# EAGLE design untitled.bcpb (EAGLE 5.06)
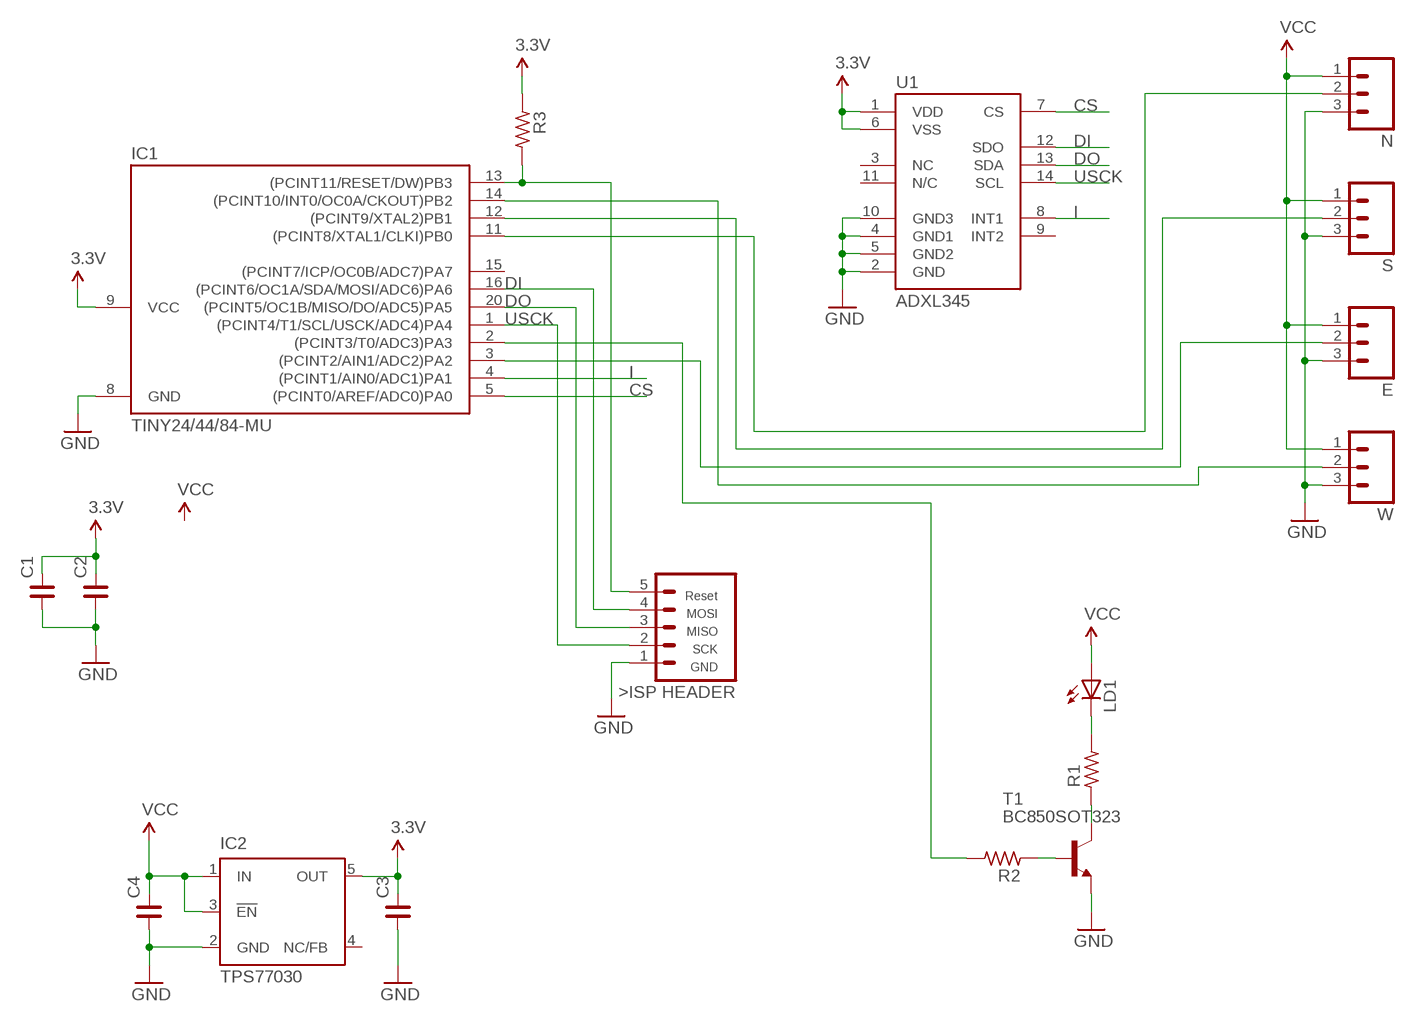
[diagram p0: schematic, sheet 1]

## Parts
C1  C_0402  [C0402]
C2  C_0402  [C0402]
C3  C_0805  [C0805]
C4  C_0805  [C0805]
E  M03LOCK  [1X03_LOCK]
IC1  TINY24/44/84-MU  [QFN/MLF20]
IC2  TPS77030  [SOT23-DBV]
LD1  LEDP-LCC-2  [P-LCC-2]
N  M03LOCK  [1X03_LOCK]
R1  R_0603  [R0603]
R2  R_0603  [R0603]
R3  R_0603  [R0603]
S  M03LOCK  [1X03_LOCK]
T1  BC850SOT323  [SOT323-BEC]
U1  ADXL345  [LGA14]
U$1  ISPHEADER  [1X05]
W  M03LOCK  [1X03_LOCK]

## Nets
3.3V: C1.2 C2.2 C3.2 IC1.9(VCC) IC2.5(OUT) R3.1 U1.1(VDD) U1.6(VSS)
CS: IC1.5((PCINT0/AREF/ADC0)PA0) U1.7(CS)
DI: IC1.16((PCINT6/OC1A/SDA/MOSI/ADC6)PA6) U1.12(SDO) U$1.4(MOSI)
DO: IC1.20((PCINT5/OC1B/MISO/DO/ADC5)PA5) U1.13(SDA) U$1.3(MISO)
GND: C1.1 C2.1 C3.1 C4.1 E.3 IC1.8(GND) IC2.2(GND) N.3 S.3 T1.E U1.2(GND) U1.4(GND1) U1.5(GND2) U1.10(GND3) U$1.1(GND) W.3
I: IC1.4((PCINT1/AIN0/ADC1)PA1) U1.8(INT1)
N$1: IC1.13((PCINT11/RESET/DW)PB3) R3.2 U$1.5(RST)
N$2: IC1.12((PCINT9/XTAL2)PB1) S.2
N$3: LD1.C R1.2
N$4: R1.1 T1.C
N$5: R2.1 T1.B
N$8: IC1.11((PCINT8/XTAL1/CLKI)PB0) N.2
N$11: E.2 IC1.3((PCINT2/AIN1/ADC2)PA2)
N$12: IC1.14((PCINT10/INT0/OC0A/CKOUT)PB2) W.2
N$13: IC1.2((PCINT3/T0/ADC3)PA3) R2.2
USCK: IC1.1((PCINT4/T1/SCL/USCK/ADC4)PA4) U1.14(SCL) U$1.2(SCK)
VCC: C4.2 E.1 IC2.1(IN) IC2.3(!EN) LD1.A N.1 S.1 W.1
Unconnected: IC1.15((PCINT7/ICP/OC0B/ADC7)PA7) IC2.4(NC/FB) U1.3(NC) U1.9(INT2) U1.11(N/C)

## Library data of the parts
C1-C4 = rc-master:C_: NON-POLARIZED CAP
E N S W = SparkFun:M03: Header 3 Standard 3-pin 0.1" header. Use with straight break away headers (SKU : PRT-00116), right angle break away headers (PRT-00553), swiss pins (PRT-00743), machine pins (PRT-00117), and female headers (PRT-00115). Molex polarized connector foot print use with SKU : PRT-08232 with associated crimp pins and housings.
IC1 = avr-5:TINY24/44/84
IC2 = texas:TPS770*: ULTRALOW-POWER 50-mA LOW-DROPOUT LINEAR REGULATORS 50-mA Low-Dropout Regulator Source: http://focus.ti.com/lit/ds/symlink/tps77001.pdf
LD1 = led:LED: LED OSRAM: - CHIPLED LG R971, LG N971, LY N971, LG Q971, LY Q971, LO R971, LY R971 LH N974, LH R974 LS Q976, LO Q976, LY Q976 LO Q996 - Hyper CHIPLED LW Q18S LB Q993, LB Q99A, LB R99A - SideLED LS A670, LO A670, LY A670, LG A670, LP A670 LB A673, LV A673, LT A673, LW A673 LH A674 LY A675 LS A676, LA A676, LO A676, LY A676, LW A676 LS A679, LY A679, LG A679 - Hyper Micro SIDELED® LS Y876, LA Y876, LO Y876, LY Y876 LT Y87S - SmartLED LW L88C, LW L88S LB L89C, LB L89S, LG L890 LS L89K, LO L89K, LY L89K LS L896, LA L896, LO L896, LY L896 - TOPLED LS T670, LO T670, LY T670, LG T670, LP T670 LSG T670, LSP T670, LSY T670, LOP T670, LYG T670 LG T671, LOG T671, LSG T671 LB T673, LV T673, LT T673, LW T673 LH T674 LS T676, LA T676, LO T676, LY T676, LB T676, LH T676, LSB T676, LW T676 LB T67C, LV T67C, LT T67C, LS T67K, LO T67K, LY T67K, LW E67C LS E67B, LA E67B, LO E67B, LY E67B, LB E67C, LV E67C, LT E67C LW T67C LS T679, LY T679, LG T679 LS T770, LO T770, LY T770, LG T770, LP T770 LB T773, LV T773, LT T773, LW T773 LH T774 LS E675, LA E675, LY E675, LS T675 LS T776, LA T776, LO T776, LY T776, LB T776 LHGB T686 LT T68C, LB T68C - Hyper Mini TOPLED® LB M676 - Mini TOPLED Santana® LG M470 LS M47K, LO M47K, LY M47K Source: http://www.osram.convergy.de/
R1-R3 = rc-master:R_: RESISTOR
T1 = additional:BC850: NPN TRANSISTOR
U1 = SparkFun:ADXL345
U$1 = tuxgraphics:ISPHEADER: ISP Header for tuxgraphics.org AvrUsb500 programmer

## Board
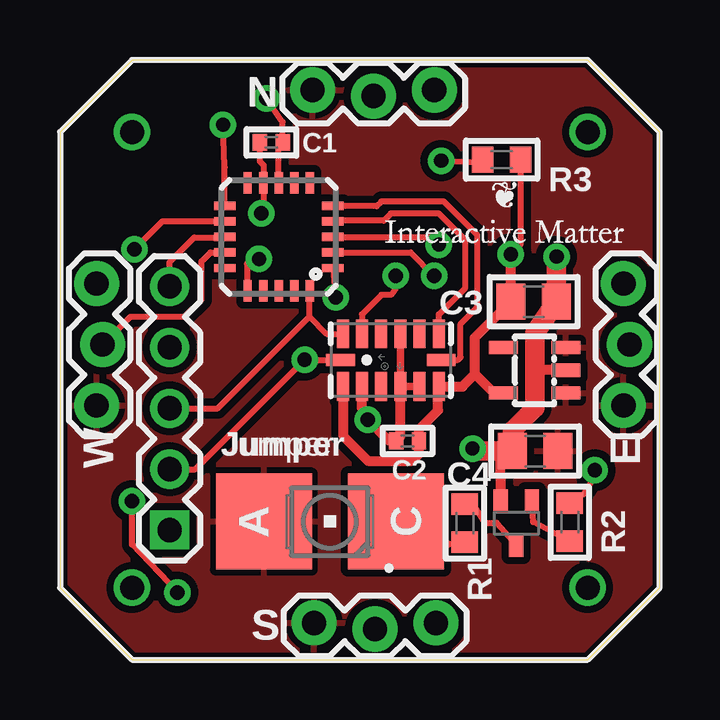
[diagram p1: board, top side]
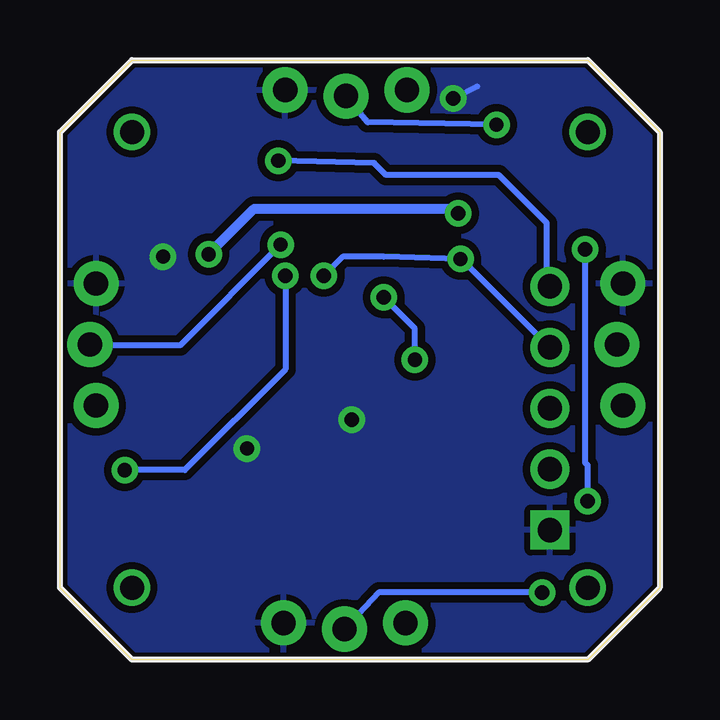
[diagram p2: board, bottom side, seen from below]

Size 25 x 25 mm. Coordinates in mm from the lower left corner, seen from the top.
Outline: 0,3 3,0 22,0 25,3 25,22 22,25 3,25 0,22 0,3
Copper layers (1*16): Top 0.035mm / dielectric 1.5mm / Bottom 0.035mm
Design rules "SparkFun": minimum track width 8mil, minimum drill 20mil, track to track 8mil, track to pad 8mil, pad to pad 8mil, via to via 8mil, smd to smd 0mil, copper to edge 10mil, drill to drill 8mil, minimum pad ring 12mil, minimum via ring 10mil, stop-mask expansion 4mil, vias tented up to drill 25mil, thermal gap 10mil

### Footprints (pad centres in the part's own frame; a part is rotated, then mirrored left to right if it is on the bottom)
C0402 = smd 0.6 x 0.7: 1 -0.476,0; 2 0.476,0
C0805 = smd 1.2 x 1.5: 1 -0.953,0; 2 0.953,0
1X03_LOCK = drill 1.016 pad 1.88 round: 1 0,0.127; 2 2.54,-0.127; 3 5.08,0.127
QFN/MLF20 = smd 0.9 x 0.35: 1 -2.25,1.3; 2 -2.25,0.65; 3 -2.25,0; 4 -2.25,-0.65; 5 -2.25,-1.3; 11 2.25,-1.3; 12 2.25,-0.65; 13 2.25,0; 14 2.25,0.65; 15 2.25,1.3 | smd 0.35 x 0.9: 6 -1.3,-2.25; 7 -0.65,-2.25; 8 0,-2.25; 9 0.65,-2.25; 10 1.3,-2.25; 16 1.3,2.25; 17 0.65,2.25; 18 0,2.25; 19 -0.65,2.25; 20 -1.3,2.25
SOT23-DBV = smd 0.55 x 1.2: 1 -0.95,-1.3; 2 0,-1.3; 3 0.95,-1.3; 4 0.95,1.3; 5 -0.95,1.3
P-LCC-2 = smd 4 x 4: A 0,2.75; C 0,-2.75
R0603 = smd 0.9 x 1.1: 1 -0.794,0; 2 0.794,0
SOT323-BEC = smd 0.6 x 1: B -0.65,-0.9; C 0,0.9; E 0.65,-0.9
LGA14 = smd 0.5 x 1.2: 1 2,1.1; 2 1.2,1.1; 3 0.4,1.1; 4 -0.4,1.1; 5 -1.2,1.1; 6 -2,1.1; 8 -2,-1.1; 9 -1.2,-1.1; 10 -0.4,-1.1; 11 0.4,-1.1; 12 1.2,-1.1; 13 2,-1.1 | smd 1.2 x 0.5: 7 -2.1,0; 14 2.1,0
1X05 = drill 1.016 square: 1 0,0 | drill 1.016 round: 2 2.54,0; 3 5.08,0; 4 7.62,0; 5 10.16,0

### Placement (x,y rotation side)
C1  8.81,21.56 180 top
C2  14.49,9.12 0 top
C3  19.75,14.92 180 top
C4  19.81,8.69 0 top
E  23.62,10.6 90 top
IC1  9.12,17.62 180 top
IC2  19.79,12.06 90 top
LD1  11.25,5.75 90 top
N  10.53,23.62 0 top
R1  16.88,5.69 270 top
R2  21.25,5.72 90 top
R3  18.41,20.85 180 top
S  10.6,1.4 0 top
T1  19.03,5.69 180 top
U1  13.79,12.48 180 top
U$1  4.57,5.4 90 top
U$2  [VERY_SMALL]  13.4,16.9 0 top
W  1.65,10.6 90 top

### Tracks (layer width: path | path; a pad name or v marks a point on that pad's centre or on a via)
3.3V  (via drill 0.6)
  Top 0.254: C1.2 8.34,20.76 8.5,20.6 8.5,19.9 | 8.5,19.9 IC1.9 | 8.5,19.9 8.5,18.9 v8.4,18.6 | C3.2 | R3.1 19.21,17.31 v18.8,16.9
  Top 0.305: 15.76,11.35 U1.6 | 11.82,11.35 U1.1
  Top 0.406: 15.76,11.35 15.76,10.39 14.97,9.59 C2.2 14.97,8.58 14.68,8.29 12.84,8.29 11.82,9.31 11.82,11.35 | C3.2 v18.8,16.9 | C3.2 17.3,13.43 17.3,11.9 | 17.3,11.9 16.78,11.38 U1.6 | 17.3,11.9 18.09,11.11 IC2.5
  Bottom 0.406: v8.4,18.6 8.5,18.6 8.7,18.8 16.9,18.8 v18.8,16.9
CS
  Top 0.254: U1.7 16.18,12.48 16.2,12.5 16.6,12.5 16.7,12.6 16.7,14 17.4,14.7 17.4,17.7 16,19.1 13.4,19.1 13.2,18.9 11.4,18.9 IC1.5
DI  (via drill 0.6)
  Top 0.254: U1.12 12.59,14.39 13.4,15.2 13.8,15.2 14,15.5 v14,16 | v8.3,16.7 8.4,17.1 7.8,16.5 7.8,15.4 IC1.16
  Bottom 0.254: U$1.4 8.26,16.7 8.45,16.75 v8.3,16.7 11.5,16.8 13.2,16.8 v14,16
DO
  Top 0.254: U1.13 11.12,13.58 10.4,14.3 | 10.4,14.3 10.4,15.35 IC1.20 | U$1.3 6.58,10.48 10.4,14.3
GND  (via drill 0.6)
  Top 0.254: IC1.8 9.12,21.39 C1.1 9.29,22.41 v8.6,23.4 | v20.7,16.8
  Top 0.305: U1.5 U1.4 U1.10 | 14.19,9.29 C2.1 13.73,9.12
  Top 0.406: 14.19,9.29 U1.4 | U1.2 12.59,10.51 v12.84,10.01 13.73,9.12 | T1.E 18.36,8.71 C4.1 18.86,9.56 | IC2.2 21.05,12.1 19.8,12.1
  Top 0.813: v17.2,8.8 17.29,8.69 C4.1 | v20.7,16.8 C3.1 19.8,13.62 19.8,12.1 19.8,10.5 18.86,9.56
  Bottom 0.254: v8.6,23.4 7.6,23.9 | v20.7,16.8 20.7,16.9 20.6,17
  Bottom 0.305: v12.84,10.01 13.03,10.26 13.09,10.32
  pour Bottom (isolate 0.305): -0.5,-0.5 -0.5,25.5 25.5,25.5 25.5,-0.5
I
  Top 0.254: U1.8 15.79,14.39 16.9,15.5 16.9,17.5 15.8,18.6 13.8,18.6 13.5,18.3 11.4,18.3 IC1.4
N$1  (via drill 0.6)
  Top 0.254: U$1.5 4.57,16.57 5.6,17.6 6.85,17.6 IC1.13 | R3.2 17.35,20.75 v15.9,20.8
  Bottom 0.254: v15.9,20.8 11.9,20.7 11.4,20.2 6.7,20.2 4.7,18.2 4.7,16.23 4.57,16.1 U$1.5
N$2  (via drill 0.6)
  Top 0.254: IC1.12 4.28,18.27 v3.1,17.1 | v3,6.6 3,4.8 v4.9,2.8
  Bottom 0.254: v3.1,17.1 3.1,8.2 3,8.1 v3,6.6 | v4.9,2.8 11.71,2.8 S.2
N$3
  Top 0.254: LD1.C 15.35,5.65 16.21,4.79 R1.2
N$4
  Top 0.254: T1.C 18.22,5.7 17.7,5.7 17.22,6.48 R1.1
N$5
  Top 0.254: T1.B 19.73,5.73 R2.1
N$6  (via drill 1)
  other vias: 3,22
N$7  (via drill 1)
  other vias: 22,22
N$8  (via drill 0.6)
  Top 0.254: IC1.11 6.87,20.53 v6.8,22.3
  Bottom 0.254: v6.8,22.3 12.18,22.4 N.2
N$9  (via drill 1)
  other vias: 22,3
N$10  (via drill 1)
  other vias: 3,3
N$11  (via drill 0.6)
  Top 0.254: IC1.3 15.47,17.62 v15.8,17.3
  Bottom 0.254: E.2 23.71,13.1 20,13.1 v15.8,17.3
N$12
  Top 0.254: IC1.14 6.28,16.98 5.9,16.6 5.9,15 5.2,14.3 2.94,14.3 W.2
N$13  (via drill 0.6)
  Top 0.254: IC1.2 14.62,16.98 v15.6,16 | v22.3,7.9 22.2,7.5 | 22.2,7.5 22.3,8 | 22.2,7.5 21.8,6.87 R2.2
  Bottom 0.254: v15.6,16 15.6,12.1 19.8,7.9 v22.3,7.9
USCK  (via drill 0.6)
  Top 0.254: U1.14 10.22,12.48 v10.2,12.5 5.64,7.94 U$1.2 | v11.5,15.1 11.4,16.3 IC1.1
  Bottom 0.254: v10.2,12.5 10.2,13.8 v11.5,15.1
VCC
  pour Top (isolate 0.305): -0.5,25.5 25.5,25.5 25.5,-0.5 -0.5,-0.5

### Text on the board
tNames: Jumper
_tsilk: N | C1 | R3 | C3 | W | Jumper | C2 | E | C4 | R2 | A | C | R1 | S